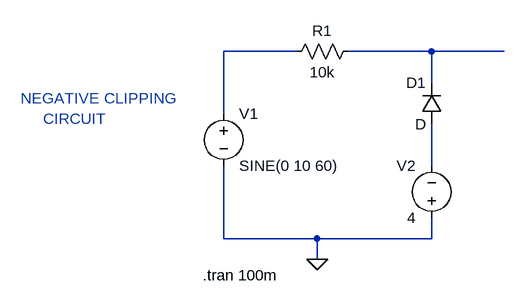
[diagram p0: schematic Negative Clipping circuit.asc]
Negative Clipping circuit.asc, the LTspice schematic file:
Version 4
SHEET 1 880 680
WIRE 80 0 -32 0
WIRE 288 0 160 0
WIRE 400 0 288 0
WIRE 288 48 288 0
WIRE -32 96 -32 0
WIRE 288 176 288 112
WIRE -32 288 -32 176
WIRE 112 288 -32 288
WIRE 288 288 288 256
WIRE 288 288 112 288
WIRE 112 320 112 288
FLAG 112 320 0
SYMBOL voltage -32 80 R0
WINDOW 123 0 0 Left 0
WINDOW 39 0 0 Left 0
SYMATTR InstName V1
SYMATTR Value SINE(0 10 60)
SYMBOL res 176 -16 R90
WINDOW 0 0 56 VBottom 2
WINDOW 3 32 56 VTop 2
SYMATTR InstName R1
SYMATTR Value 10k
SYMBOL voltage 288 272 R180
WINDOW 0 24 96 Left 2
WINDOW 3 24 16 Left 2
WINDOW 123 0 0 Left 0
WINDOW 39 0 0 Left 0
SYMATTR InstName V2
SYMATTR Value 4
SYMBOL diode 304 112 R180
WINDOW 0 24 64 Left 2
WINDOW 3 24 0 Left 2
SYMATTR InstName D1
TEXT -64 344 Left 2 !.tran 100m
TEXT -344 72 Left 2 ;NEGATIVE CLIPPING \n     CIRCUIT

The netlist it stands for:
* Negative Clipping circuit.asc
V1 N001 0 SINE(0 10 60)
R1 N002 N001 10k
V2 0 N003 4
D1 N003 N002 D
.model D D
.lib standard.dio
.tran 100m
* NEGATIVE CLIPPING
*      CIRCUIT
.backanno
.end